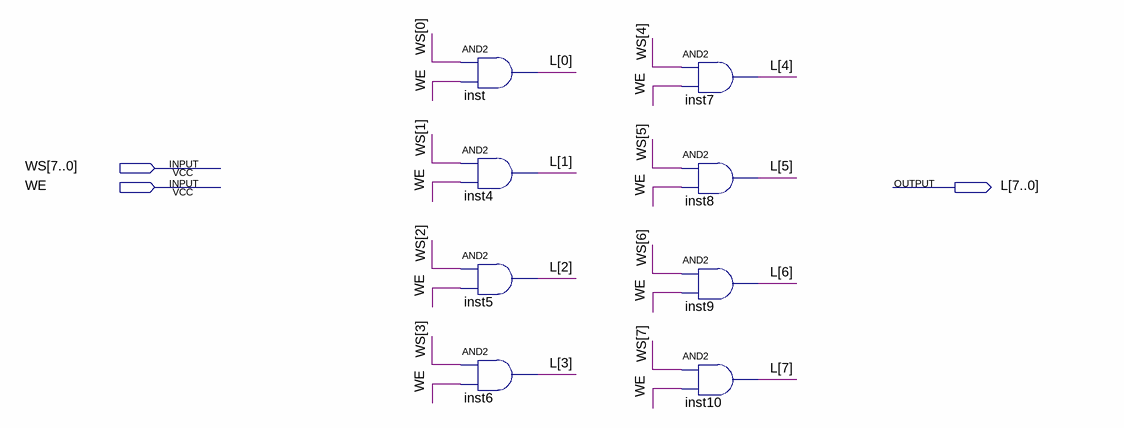
[diagram p0: schematic sheet]
// Quartus schematic WriteSelect.bdf as structural Verilog: 8 symbols, 3 pins
module WriteSelect (
  input  [7:0] WS,
  input  WE,
  output [7:0] L
);

  and inst (L[0], WS[0], WE);
  and inst4 (L[1], WS[1], WE);
  and inst5 (L[2], WS[2], WE);
  and inst6 (L[3], WS[3], WE);
  and inst7 (L[4], WS[4], WE);
  and inst8 (L[5], WS[5], WE);
  and inst9 (L[6], WS[6], WE);
  and inst10 (L[7], WS[7], WE);
endmodule
